# EAGLE design plan (EAGLE 7.2.0)
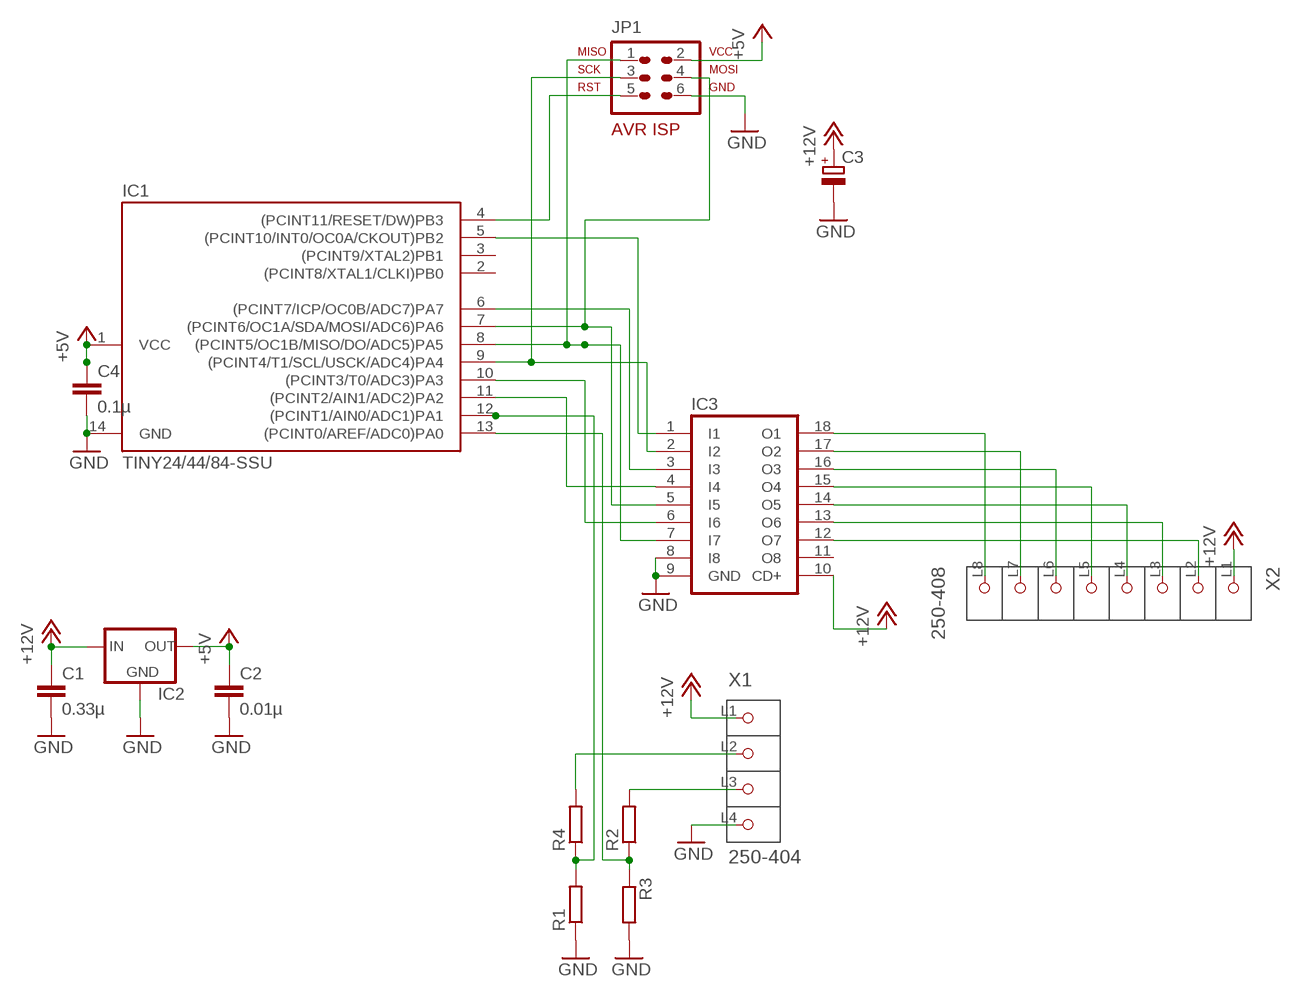
[diagram p0: schematic, sheet 1]

## Parts
C1  0.33µ  C-EU025-025X050  [C025-025X050]
C2  0.01µ  C-EU025-025X050  [C025-025X050]
C3  CPOL-EUSANYO_B  [SANYO-OSCON_B]
C4  0.1µ  C-EU025-030X050  [C025-030X050]
IC1  TINY24/44/84-SSU  [SOIC14]
IC2  78LXX  [78LXX]
IC3  ULN2803ASMD  [SO18W]
JP1  AVR-ISP-6VERT  [AVR-ISP-6]
R1  R-EU_0204/2V  [0204V]
R2  R-EU_0204/2V  [0204V]
R3  R-EU_0204/2V  [0204V]
R4  R-EU_0207/10  [0207/10]
X1  250-404  [P-250-404]
X2  250-408  [P-250-408]

## Nets
+5V: C2.1 C4.1 IC1.1(VCC) IC2.OUT JP1.2
+12V: C1.1 C3.+ IC2.IN IC3.10(CD+) X1.L1(P1) X2.L1(P1)
GND: C1.2 C2.2 C3.- C4.2 IC1.14(GND) IC2.GND IC3.8(I8) IC3.9(GND) JP1.6 R1.1 R3.2 X1.L4(P4)
N$1: R4.2 X1.L2(P2)
N$2: IC1.4((PCINT11/RESET/DW)PB3) JP1.5
N$3: IC1.8((PCINT5/OC1B/MISO/DO/ADC5)PA5) IC3.7(I7) JP1.1
N$4: IC1.7((PCINT6/OC1A/SDA/MOSI/ADC6)PA6) IC3.5(I5) JP1.4
N$5: IC1.9((PCINT4/T1/SCL/USCK/ADC4)PA4) IC3.2(I2) JP1.3
N$6: IC1.5((PCINT10/INT0/OC0A/CKOUT)PB2) IC3.1(I1)
N$7: IC1.11((PCINT2/AIN1/ADC2)PA2) IC3.4(I4)
N$8: IC1.10((PCINT3/T0/ADC3)PA3) IC3.6(I6)
N$10: IC3.18(O1) X2.L8(P8)
N$11: IC3.17(O2) X2.L7(P7)
N$12: IC3.16(O3) X2.L6(P6)
N$13: IC3.15(O4) X2.L5(P5)
N$14: IC3.14(O5) X2.L4(P4)
N$15: IC3.13(O6) X2.L3(P3)
N$16: IC3.12(O7) X2.L2(P2)
N$17: R2.2 X1.L3(P3)
N$18: IC1.12((PCINT1/AIN0/ADC1)PA1) R1.2 R4.1
N$19: IC1.13((PCINT0/AREF/ADC0)PA0) R2.1 R3.1
N$20: IC1.6((PCINT7/ICP/OC0B/ADC7)PA7) IC3.3(I3)
Unconnected: IC1.2((PCINT8/XTAL1/CLKI)PB0) IC1.3((PCINT9/XTAL2)PB1) IC3.11(O8)

## Library data of the parts
C1 C2 C4 = rcl:C-EU: CAPACITOR, European symbol
C3 = rcl:CPOL-EU: POLARIZED CAPACITOR, European symbol
IC1 = avr-7:TINY24/44/84
IC2 = v-reg:78LXX: VOLTAGE REGULATOR
IC3 = driver:ULN2803A: DRIVER ARRAY
JP1 = avr-7:AVR-ISP-6: AVR ISP-6 Serial Programming Header
R1-R4 = rcl:R-EU_: RESISTOR, European symbol
X1 = con-wago_250:250-404: Serie 250, 1-Leiter-Klemmenleiste für Leiterplatten 1 Lötstift/Pol versetzt / Series 250, 1-conductor PCB terminal strip 1 solder pin/pole, staggered Polzahl / Pole No.: 4 Rastermaß / Pitch: 2.5 - 2.5 mm Bemessungsspannung / Rated Voltage: 160 V Nennstrom / Nominal Current: 4 A Leiterquerschnitt / Conductor Size: 0.14 - 0.5 mm2 Anschlusstechnik / Connection Technology: CAGE CLAMP® S Lötstiftlänge: / Solder Pin Length: 3.6 mm Leitereinführung (zur Platine) / Conductor entry angle (to PCB): 45 ° Farbe / Color: grau / gray Stand: 01.01.2014. Die jeweils aktuellen Daten zu diesem Artikel finden Sie in unserem Produktkatalog, den Sie unter www.wago.com einsehen können. As of: 01/01/2014. Please find the newest data for this article in our product catalogue, which can be viewed under www.wago.com.
X2 = con-wago_250:250-408: Serie 250, 1-Leiter-Klemmenleiste für Leiterplatten 1 Lötstift/Pol versetzt / Series 250, 1-conductor PCB terminal strip 1 solder pin/pole, staggered Polzahl / Pole No.: 8 Rastermaß / Pitch: 2.5 - 2.5 mm Bemessungsspannung / Rated Voltage: 160 V Nennstrom / Nominal Current: 4 A Leiterquerschnitt / Conductor Size: 0.14 - 0.5 mm2 Anschlusstechnik / Connection Technology: CAGE CLAMP® S Lötstiftlänge: / Solder Pin Length: 3.6 mm Leitereinführung (zur Platine) / Conductor entry angle (to PCB): 45 ° Farbe / Color: grau / gray Stand: 01.01.2014. Die jeweils aktuellen Daten zu diesem Artikel finden Sie in unserem Produktkatalog, den Sie unter www.wago.com einsehen können. As of: 01/01/2014. Please find the newest data for this article in our product catalogue, which can be viewed under www.wago.com.

## Board
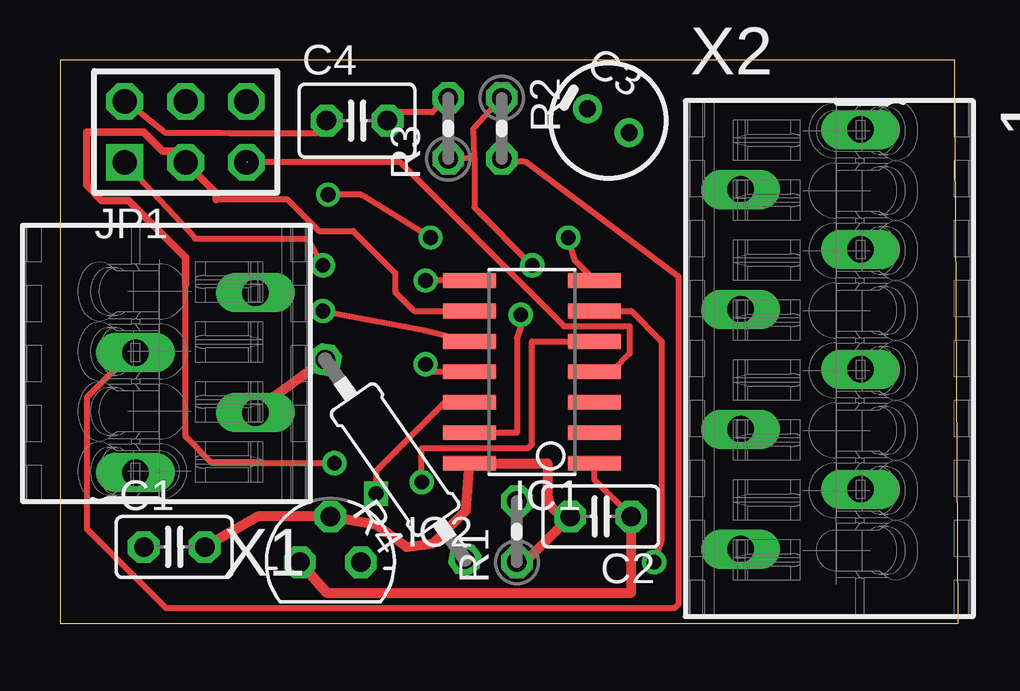
[diagram p1: board, top side]
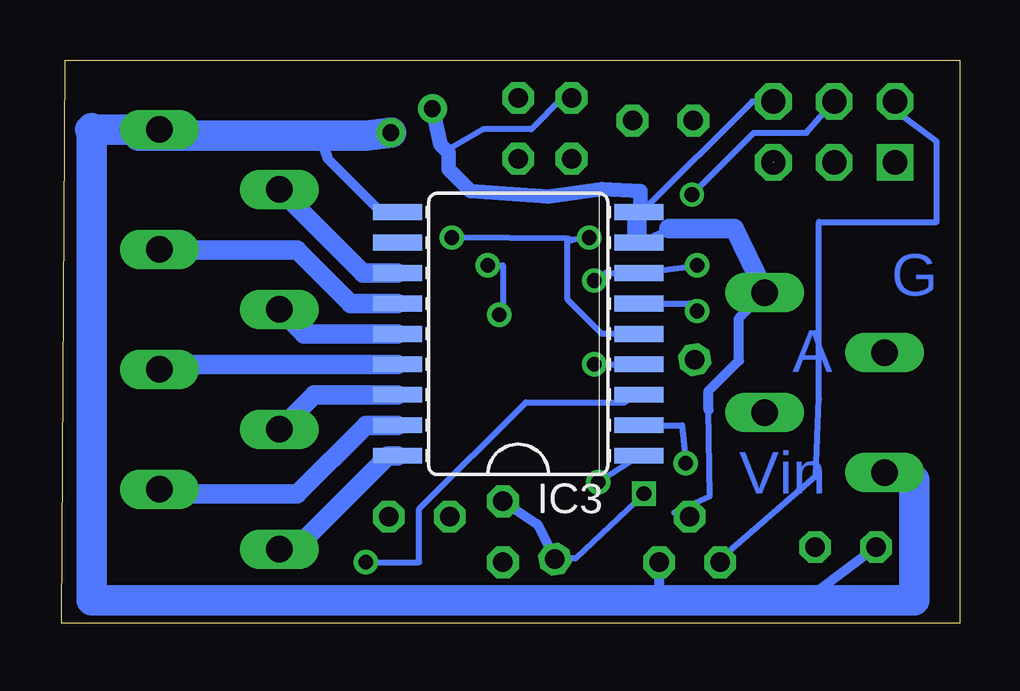
[diagram p2: board, bottom side, seen from below]

Size 37.45 x 23.48 mm. Coordinates in mm from the lower left corner, seen from the top.
Outline: 0,0 37.45,0 37.29,23.48 0,23.48 0,0
Copper layers (1*16): Top 0.035mm / dielectric 1.5mm / Bottom 0.035mm
Design rules "default": minimum track width 10mil, minimum drill 24mil, track to track 8mil, track to pad 8mil, pad to pad 8mil, via to via 8mil, smd to smd 8mil, copper to edge 40mil, drill to drill 8mil, minimum pad ring 10mil, minimum via ring 8mil, stop-mask expansion 4mil, vias tented up to drill 0mil, thermal gap 10mil

### Footprints (pad centres in the part's own frame; a part is rotated, then mirrored left to right if it is on the bottom)
C025-025X050 = drill 0.813 octagon: 1 -1.27,0; 2 1.27,0
SANYO-OSCON_B = drill 0.7 pad 1.1: + 1,0; - -1,0
C025-030X050 = drill 0.813 octagon: 1 -1.27,0; 2 1.27,0
SOIC14 = smd 0.61 x 2.21: 1 -3.81,-2.603; 2 -2.54,-2.603; 3 -1.27,-2.603; 4 0,-2.603; 5 1.27,-2.603; 6 2.54,-2.603; 7 3.81,-2.603; 8 3.81,2.603; 9 2.54,2.603; 10 1.27,2.603; 11 0,2.603; 12 -1.27,2.603; 13 -2.54,2.603; 14 -3.81,2.603
78LXX = drill 0.813 octagon: GND 0,1.905; IN 1.27,0; OUT -1.27,0
SO18W = smd 0.66 x 2.032: 1 -5.08,-5.029; 2 -3.81,-5.029; 3 -2.54,-5.029; 4 -1.27,-5.029; 5 0,-5.029; 6 1.27,-5.029; 7 2.54,-5.029; 8 3.81,-5.029; 9 5.08,-5.029; 10 5.08,5.029; 11 3.81,5.029; 12 2.54,5.029; 13 1.27,5.029; 14 0,5.029; 15 -1.27,5.029; 16 -2.54,5.029; 17 -3.81,5.029; 18 -5.08,5.029
AVR-ISP-6 = drill 1.016 square: 1 -2.54,-1.27 | drill 1.016 octagon: 2 -2.54,1.27; 3 0,-1.27; 4 0,1.27; 5 2.54,-1.27; 6 2.54,1.27
0204V = drill 0.813 octagon: 1 -1.27,0; 2 1.27,0
0207/10 = drill 0.813 octagon: 1 -5.08,0; 2 5.08,0
P-250-404 = drill 1.1 long: L1 1.3,4.513; L2 -3.7,2.013; L3 1.3,-0.487; L4 -3.7,-2.987
P-250-408 = drill 1.1 long: L1 1.3,9.472; L2 -3.7,6.972; L3 1.3,4.472; L4 -3.7,1.972; L5 1.3,-0.528; L6 -3.7,-3.028; L7 1.3,-5.528; L8 -3.7,-8.028

### Placement (x,y rotation side)
C1  4.76,3.18 0 top
C2  22.54,4.45 180 top
C3  22.86,20.95 330 top
C4  12.38,20.95 0 top
IC1  19.68,10.48 90 top
IC2  11.27,2.54 0 top
IC3  18.42,12.07 90 bottom
JP1  5.24,20.48 0 top
R1  19.05,3.81 90 top
R2  18.42,20.64 270 top
R3  16.19,20.64 90 top
R4  13.97,6.83 125 top
X1  4.45,10.8 180 top
X2  32.07,11.11 0 top

### Tracks (layer width: path | path; a pad name or v marks a point on that pad's centre or on a via)
+5V
  Top 0.254: C4.1 10.72,20.43 7.06,20.43 6.76,20.45 4.39,20.45 2.78,21.76 JP1.2 | 22.15,6.67 IC1.1 22.29,5.97 C2.1
  Top 0.406: IC2.OUT 11.11,1.27 23.81,1.27 C2.1
  Bottom 0.254: JP1.2 2.62,21.76 2.62,21.3 0.97,20.09 0.97,16.73 5.87,16.73 5.87,9.37 6.01,6.13 9.98,2.71 IC2.OUT
+12V
  Bottom 0.254: 22.61,16.95 23.29,16.95 IC3.10
  Bottom 0.406: 26.68,20.33 26.35,19.38 26.35,19.37 24.13,17.15 IC3.10 | IC2.IN 12.54,0.95 | C1.1 6.03,1.27 8.26,0.95
  Bottom 1.27: C3.+ 24.77,20.33 26.68,20.33 33.97,20.33 | 34.24,20.33 33.97,20.33 | X1.L1 1.91,5.96 1.91,0.95 8.26,0.95 12.54,0.95 36.2,0.95 36.2,20.64 36.25,20.58 X2.L1 33.71,20.58 33.97,20.33
GND
  Top 0.254: 15.98,21.76 15.84,21.62 | 15.84,21.62 15.52,21.3 13.46,21.3 C4.2 | R3.2 15.88,21.59 15.84,21.62
  Top 0.406: C1.2 8.26,4.44 IC2.GND 13.18,4.13 14.45,3.18 15.56,3.33 16.92,4.7 IC1.14 20.32,6.67 20.32,5.4 arc90 C2.2 19.37,2.54 R1.1
  Bottom 0.254: 13.39,17.18 IC3.9 | 13.31,17.41 IC3.9 | 21.32,19.62 21.4,19.7 19.86,20.6 17.87,20.6 16.56,21.91 R3.2 | IC3.8 13.23,15.81 12.14,16.45 IC3.8 | IC3.9 13.23,17.18 8.66,21.76 7.8,21.76 JP1.6 | 13.46,16.04 IC3.8 | 13.46,16.95 IC3.9 | 8.2,13.98 8.22,14 8.26,13.97 X1.L4 | 10.48,8.89 10.43,5.3 11.91,4.61 IC2.GND | 22.22,21.59 C3.-
  Bottom 0.406: 10.48,8.89 10.48,9.68 9.21,10.95 9.21,12.72 X1.L4
  Bottom 0.61: 13.31,17.41 13.31,18.01 14.92,18.1 17.14,17.78 20.4,18.01 21.32,18.94 21.32,19.62 | C3.- | C3.- 21.66,19.95 21.4,19.7
  Bottom 0.813: 13.46,16.95 13.46,16.04 | 12.14,16.45 9.4,16.45 8.22,14
N$1
  Top 0.406: R4.2 8.14,8.87 X1.L2
N$2  (1 unrouted)
  Top 0.254: 7.8,19.24 14.15,19.24 21.01,12.38 23.75,12.38 23.75,11.24 23.06,10.55 22.38,10.55 IC1.4
N$3  (via drill 0.61)
  Top 0.254: JP1.1 5.63,16.07 5.63,16.03 10.32,16.03 v10.95,14.92 | IC1.8 v15.24,14.29
  Bottom 0.254: v15.24,14.29 15.08,14.29 14.76,14.61 IC3.7 v10.95,14.92
N$4  (via drill 0.61)
  Top 0.254: v21.18,16.08 21.46,15.13 22.15,14.44 IC1.7 | v11.18,17.87 12.55,17.87 v15.45,16.08
  Bottom 0.254: v11.18,17.87 8.59,20.45 6.39,20.45 5.41,21.6 5.13,21.76 JP1.4 | v15.45,16.08 16.19,15.97 16.35,16.03 16.35,15.87 | IC3.5 14.92,12.07 16.35,13.49 16.35,15.87 | 16.35,15.87 16.38,16.03 v21.18,16.08
N$5  (via drill 0.61)
  Top 0.254: 16.89,12.84 IC1.9 14.76,13.02 13.97,13.81 13.97,14.61 12.22,16.35 10.8,16.35 9.48,17.67 6.51,17.67 | v11.43,6.67 6.35,6.67 5.24,7.78 5.24,14.13
  Top 0.305: 5.24,14.13 5.24,15.24 2.86,17.62 1.75,17.62 1.11,18.26 1.11,20.48 3.49,20.48 4.29,19.69 4.76,19.69 JP1.3 6.51,17.94 6.51,17.67
  Bottom 0.254: IC3.2 11.59,8.26 v11.43,6.67
N$6  (via drill 0.61)
  Top 0.254: v15.08,5.87 15.08,7.3 19.53,7.3 19.68,7.46 19.68,11.75 IC1.5
  Bottom 0.254: 13.34,6.98 v15.08,5.87
  Bottom 0.406: 13.65,6.98 IC3.1 13.34,6.98
N$7  (via drill 0.61)
  Top 0.254: IC1.11 15.56,10.48 v15.24,10.8
  Bottom 0.254: v15.24,10.8 IC3.4
N$8  (via drill 0.61)
  Top 0.254: v10.95,13.02 15.18,12.22 IC1.10
  Bottom 0.254: IC3.6 11.27,13.33 v10.95,13.02
N$10
  Bottom 0.813: IC3.18 23.83,6.98 27.62,3.18 X2.L8
N$11
  Bottom 0.813: IC3.17 24.77,8.26 27.62,5.4 33.18,5.4 X2.L7
N$12
  Bottom 0.813: IC3.16 26.93,9.52 X2.L6
N$13
  Bottom 0.813: IC3.15 33.16,10.8 X2.L5
N$14
  Bottom 0.813: IC3.14 27.35,12.07 X2.L4
N$15
  Bottom 0.813: IC3.13 25.4,13.33 27.62,15.56 33.34,15.56 X2.L3
N$16
  Bottom 0.813: X2.L2 24.89,14.61 IC3.12
N$17
  Top 0.254: R2.2 18.49,19.24 19.41,19.24 25.79,14.44 25.79,0.8 25.63,0.63 4.41,0.63 1.12,3.92 1.12,9.41 2.95,11.24 X1.L3
N$18  (via drill 0.61)
  Top 0.254: IC1.12 16.03,9.21 13.18,6.35 v13.18,5.4
  Bottom 0.254: v13.18,5.4 16.03,2.7 16.85,2.7 R4.1
  Bottom 0.406: R1.2 17.62,4.13 R4.1
N$19  (via drill 0.61)
  Top 0.254: R2.1 17.25,20.64 17.27,19.39 | 17.27,19.39 R3.1 | 17.27,19.39 17.27,17.34 v19.68,14.92 | IC1.13 19.05,7.94 19.05,11.91 19.21,12.38 v19.21,12.86
  Bottom 0.254: v19.21,12.86 19.21,13.02 19.05,13.33 19.05,14.92 v19.68,14.92
N$20  (via drill 0.61)
  Top 0.254: 22.22,13.07 IC1.6 23.81,13.02 25.08,11.75 25.08,3.49 v24.77,2.54
  Bottom 0.254: v24.77,2.54 22.54,2.54 22.54,4.76 18.1,9.21 13.97,9.21 13.65,9.52 IC3.3

### Text on the board
Bottom: G | A | Vin